# EAGLE schematic Rover v1 Overall (EAGLE 9.6.2)
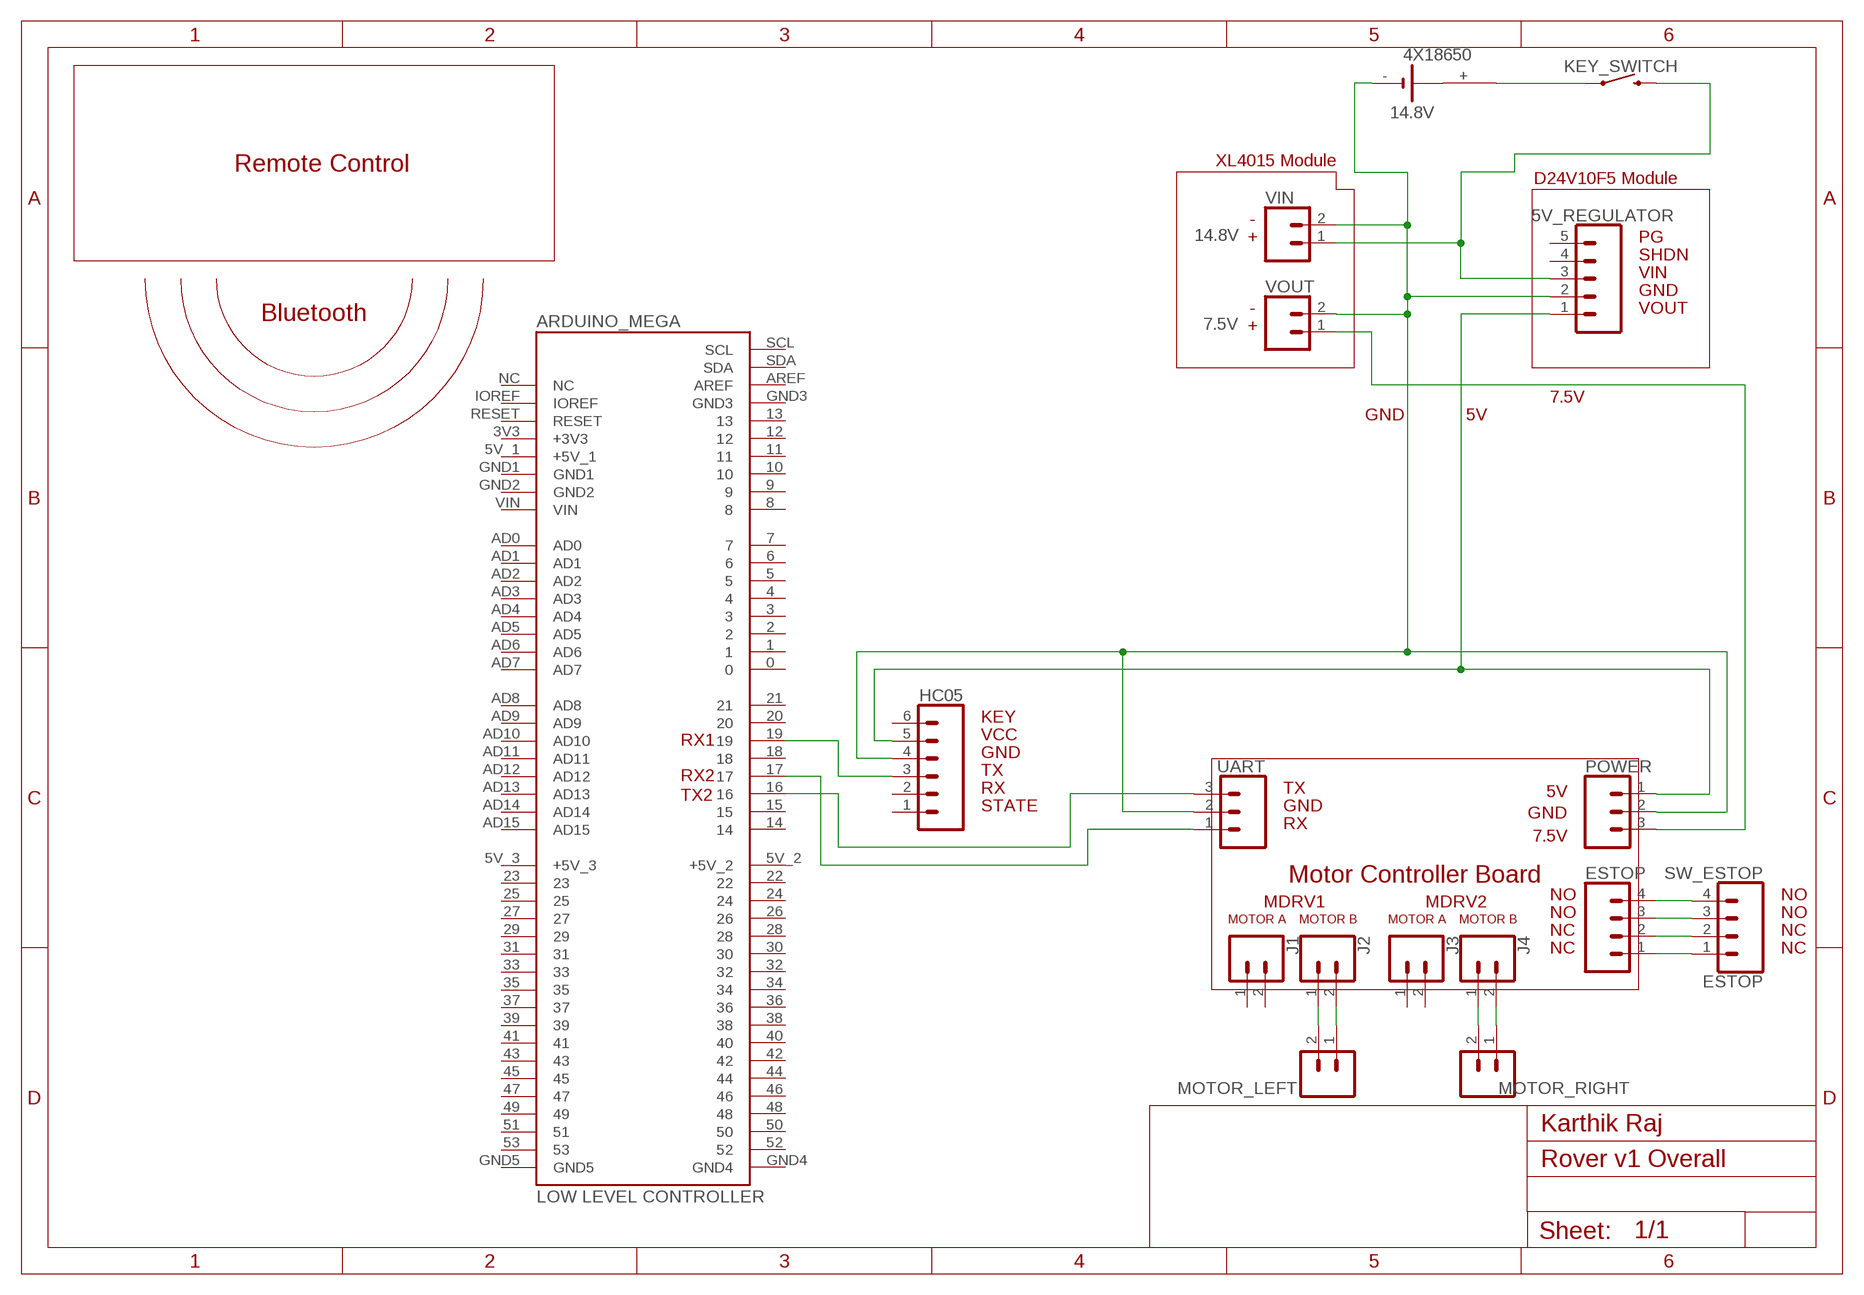
[diagram p0: schematic, sheet 1]

## Parts
4X18650  14.8V  B2430UNI  [B2430UNI]
5V_REGULATOR  CONN_05  [1X05]
ARDUINO_MEGA  LOW LEVEL CONTROLLER  A000067  [ARDUINO_A000067]
ESTOP  CONN_04PTH  [1X04]
HC05  CONN_06SILK_FEMALE_PTH  [1X06]
J1  CONN_02  [1X02]
J2  CONN_02  [1X02]
J3  CONN_02  [1X02]
J4  CONN_02  [1X02]
KEY_SWITCH  MOMENTARY-SWITCH-SPST-PTH-6.0MM  [TACTILE_SWITCH_PTH_6.0MM]
MOTOR_LEFT  CONN_02  [1X02]
MOTOR_RIGHT  CONN_02  [1X02]
POWER  CONN_03  [1X03]
SW_ESTOP  ESTOP  CONN_04PTH  [1X04]
UART  CONN_03  [1X03]
VIN  14.8V  CONN_02  [1X02]
VOUT  7.5V  CONN_02  [1X02]

## Nets
GND: 4X18650.- 5V_REGULATOR.2 HC05.4 POWER.2 UART.2 VIN.2 VOUT.2
N$1: ARDUINO_MEGA.16 UART.3
N$2: 5V_REGULATOR.3 KEY_SWITCH.3 VIN.1
N$3: ARDUINO_MEGA.17 UART.1
N$4: ESTOP.4 SW_ESTOP.4
N$5: ESTOP.3 SW_ESTOP.3
N$6: POWER.3 VOUT.1
N$7: ESTOP.2 SW_ESTOP.2
N$8: ESTOP.1 SW_ESTOP.1
N$9: J2.1 MOTOR_LEFT.2
N$10: J2.2 MOTOR_LEFT.1
N$11: J4.1 MOTOR_RIGHT.2
N$12: J4.2 MOTOR_RIGHT.1
N$13: 4X18650.+ KEY_SWITCH.1
TX: ARDUINO_MEGA.19 HC05.3
VCC: 5V_REGULATOR.1 HC05.5 POWER.1
Unconnected: 4X18650.+@1(+) 4X18650.+@2(+) 4X18650.+@3(+) 4X18650.+@4(+) 4X18650.-@1(-) 5V_REGULATOR.4 5V_REGULATOR.5 ARDUINO_MEGA.0 ARDUINO_MEGA.1 ARDUINO_MEGA.2 ARDUINO_MEGA.3 ARDUINO_MEGA.3V3(+3V3) ARDUINO_MEGA.4 ARDUINO_MEGA.5 ARDUINO_MEGA.5V_1(+5V_1) ARDUINO_MEGA.5V_2(+5V_2) ARDUINO_MEGA.5V_3(+5V_3) ARDUINO_MEGA.6 ARDUINO_MEGA.7 ARDUINO_MEGA.8 ARDUINO_MEGA.9 ARDUINO_MEGA.10 ARDUINO_MEGA.11 ARDUINO_MEGA.12 ARDUINO_MEGA.13 ARDUINO_MEGA.14 ARDUINO_MEGA.15 ARDUINO_MEGA.18 ARDUINO_MEGA.20 ARDUINO_MEGA.21 ARDUINO_MEGA.22 ARDUINO_MEGA.23 ARDUINO_MEGA.24 ARDUINO_MEGA.25 ARDUINO_MEGA.26 ARDUINO_MEGA.27 ARDUINO_MEGA.28 ARDUINO_MEGA.29 ARDUINO_MEGA.30 ARDUINO_MEGA.31 ARDUINO_MEGA.32 ARDUINO_MEGA.33 ARDUINO_MEGA.34 ARDUINO_MEGA.35 ARDUINO_MEGA.36 ARDUINO_MEGA.37 ARDUINO_MEGA.38 ARDUINO_MEGA.39 ARDUINO_MEGA.40 ARDUINO_MEGA.41 ARDUINO_MEGA.42 ARDUINO_MEGA.43 ARDUINO_MEGA.44 ARDUINO_MEGA.45 ARDUINO_MEGA.46 ARDUINO_MEGA.47 ARDUINO_MEGA.48 ARDUINO_MEGA.49 ARDUINO_MEGA.50 ARDUINO_MEGA.51 ARDUINO_MEGA.52 ARDUINO_MEGA.53 ARDUINO_MEGA.AD0 ARDUINO_MEGA.AD1 ARDUINO_MEGA.AD2 ARDUINO_MEGA.AD3 ARDUINO_MEGA.AD4 ARDUINO_MEGA.AD5 ARDUINO_MEGA.AD6 ARDUINO_MEGA.AD7 ARDUINO_MEGA.AD8 ARDUINO_MEGA.AD9 ARDUINO_MEGA.AD10 ARDUINO_MEGA.AD11 ARDUINO_MEGA.AD12 ARDUINO_MEGA.AD13 ARDUINO_MEGA.AD14 ARDUINO_MEGA.AD15 ARDUINO_MEGA.AREF ARDUINO_MEGA.GND1 ARDUINO_MEGA.GND2 ARDUINO_MEGA.GND3 ARDUINO_MEGA.GND4 ARDUINO_MEGA.GND5 ARDUINO_MEGA.IOREF ARDUINO_MEGA.NC ARDUINO_MEGA.RESET ARDUINO_MEGA.SCL ARDUINO_MEGA.SDA ARDUINO_MEGA.VIN HC05.1 HC05.2 HC05.6 J1.1 J1.2 J3.1 J3.2

## Notes on the sheet
- XL4015 Module
- Remote Control
- D24V10F5 Module
- -
- + | PG
- SHDN
- VIN
- GND
- - | VOUT
- Bluetooth
- +
- 7.5V
- GND | 5V
- KEY
- VCC
- RX1
- GND
- TX
- RX2 | 5V
- RX | TX
- TX2
- GND
- STATE | GND
- RX | 7.5V
- Motor Controller Board
- NO | NO
- MDRV1 | MDRV2
- NO | NO
- MOTOR A | MOTOR B | MOTOR A | MOTOR B
- NC | NC
- NC | NC
- Karthik Raj

## Library data of the parts
4X18650 = battery:B2430UNI: LI BATTERY
5V_REGULATOR = SparkFun-Connectors:CONN_05: Multi connection point. Often used as Generic Header-pin footprint for 0.1 inch spaced/style header connections On any of the 0.1 inch spaced packages, you can populate with these: Break Away Headers - Straight <https://www.sparkfun.com/products/116> (PRT-00116) Break Away Male Headers - Right Angle <https://www.sparkfun.com/products/553> (PRT-00553) Female Headers <https://www.sparkfun.com/products/115> (PRT-00115) Break Away Headers - Machine Pin <https://www.sparkfun.com/products/117> (PRT-00117) Break Away Female Headers - Swiss Machine Pin <https://www.sparkfun.com/products/743> (PRT-00743) For SCREWTERMINALS and SPRING TERMINALS visit here: Screw Terimnals on SparkFun.com <https://www.sparkfun.com/search/results?term=Screw+Terminals> (5mm/3.5mm/2.54mm spacing) This device is also useful as a general connection point to wire up your design to another part of your project. Our various solder wires solder well into these plated through hole pads. Hook-Up Wire - Assortment (Stranded, 22 AWG) <https://www.sparkfun.com/products/11375> (PRT-11375) Hook-Up Wire - Assortment (Solid Core, 22 AWG) <https://www.sparkfun.com/products/11367> (PRT-11367) View the entire wire category on our website here <https://www.sparkfun.com/categories/141> Special notes: Molex polarized connector foot print use with SKU : PRT-08231 with associated crimp pins and housings. 1MM SMD Version SKU: PRT-10208
ARDUINO_MEGA = Arduino Mega:A000067: ARDUINO UNO REV3 DEVELOPMENT BOARD Check availability <https://pricing.snapeda.com/parts/A000067/Arduino/view-part?ref=eda>; AVAILABILITY: In Stock; DESCRIPTION: Arduino Mega 2560 Rev3. ATmega2560 Microcontroller Mega Development Board 16MHz CPU 8KB RAM 4KB/256KB EEPROM/Flash; MF: Arduino; MP: A000067; PACKAGE: Non-Standard Arduino; PRICE: None; PURCHASE-URL: https://pricing.snapeda.com/search/part/A000067/?ref=eda
ESTOP SW_ESTOP = SparkFun-Connectors:CONN_04: Multi connection point. Often used as Generic Header-pin footprint for 0.1 inch spaced/style header connections On any of the 0.1 inch spaced packages, you can populate with these: Break Away Headers - Straight <https://www.sparkfun.com/products/116> (PRT-00116) Break Away Male Headers - Right Angle <https://www.sparkfun.com/products/553> (PRT-00553) Female Headers <https://www.sparkfun.com/products/115> (PRT-00115) Break Away Headers - Machine Pin <https://www.sparkfun.com/products/117> (PRT-00117) Break Away Female Headers - Swiss Machine Pin <https://www.sparkfun.com/products/743> (PRT-00743) For SCREWTERMINALS and SPRING TERMINALS visit here: Screw Terimnals on SparkFun.com <https://www.sparkfun.com/search/results?term=Screw+Terminals> (5mm/3.5mm/2.54mm spacing) This device is also useful as a general connection point to wire up your design to another part of your project. Our various solder wires solder well into these plated through hole pads. Hook-Up Wire - Assortment (Stranded, 22 AWG) <https://www.sparkfun.com/products/11375> (PRT-11375) Hook-Up Wire - Assortment (Solid Core, 22 AWG) <https://www.sparkfun.com/products/11367> (PRT-11367) View the entire wire category on our website here <https://www.sparkfun.com/categories/141> Special notes: Molex polarized connector foot print use with SKU : PRT-08231 with associated crimp pins and housings. 1MM SMD Version SKU: PRT-10208; PROD_ID: CONN-09696
HC05 = SparkFun-Connectors:CONN_06: Multi connection point. Often used as Generic Header-pin footprint for 0.1 inch spaced/style header connections On any of the 0.1 inch spaced packages, you can populate with these: Break Away Headers - Straight <https://www.sparkfun.com/products/116> (PRT-00116) Break Away Male Headers - Right Angle <https://www.sparkfun.com/products/553> (PRT-00553) Female Headers <https://www.sparkfun.com/products/115> (PRT-00115) Break Away Headers - Machine Pin <https://www.sparkfun.com/products/117> (PRT-00117) Break Away Female Headers - Swiss Machine Pin <https://www.sparkfun.com/products/743> (PRT-00743) Arduino Stackable Header - 6 Pin <https://www.sparkfun.com/products/9280> (PRT-09280) For SCREWTERMINALS and SPRING TERMINALS visit here: Screw Terimnals on SparkFun.com <https://www.sparkfun.com/search/results?term=Screw+Terminals> (5mm/3.5mm/2.54mm spacing) This device is also useful as a general connection point to wire up your design to another part of your project. Our various solder wires solder well into these plated through hole pads. Hook-Up Wire - Assortment (Stranded, 22 AWG) <https://www.sparkfun.com/products/11375> (PRT-11375) Hook-Up Wire - Assortment (Solid Core, 22 AWG) <https://www.sparkfun.com/products/11367> (PRT-11367) View the entire wire category on our website here <https://www.sparkfun.com/categories/141>; PROD_ID: CONN-08437
J1-J4 MOTOR_LEFT MOTOR_RIGHT VIN VOUT = SparkFun-Connectors:CONN_02: Multi connection point. Often used as Generic Header-pin footprint for 0.1 inch spaced/style header connections On any of the 0.1 inch spaced packages, you can populate with these: Break Away Headers - Straight <https://www.sparkfun.com/products/116> (PRT-00116) Break Away Male Headers - Right Angle <https://www.sparkfun.com/products/553> (PRT-00553) Female Headers <https://www.sparkfun.com/products/115> (PRT-00115) Break Away Headers - Machine Pin <https://www.sparkfun.com/products/117> (PRT-00117) Break Away Female Headers - Swiss Machine Pin <https://www.sparkfun.com/products/743> (PRT-00743) For SCREWTERMINALS and SPRING TERMINALS visit here: Screw Terimnals on SparkFun.com <https://www.sparkfun.com/search/results?term=Screw+Terminals> (5mm/3.5mm/2.54mm spacing) This device is also useful as a general connection point to wire up your design to another part of your project. Our various solder wires solder well into these plated through hole pads. Hook-Up Wire - Assortment (Stranded, 22 AWG) <https://www.sparkfun.com/products/11375> (PRT-11375) Hook-Up Wire - Assortment (Solid Core, 22 AWG) <https://www.sparkfun.com/products/11367> (PRT-11367) View the entire wire category on our website here <https://www.sparkfun.com/categories/141> Special notes: Molex polarized connector foot print use with: PRT-08233 with associated crimp pins and housings. 2.54_SCREWTERM for use with PRT-10571. 3.5mm Screw Terminal footprints for PRT-08084 5mm Screw Terminal footprints for use with PRT-08432
KEY_SWITCH = SparkFun-Switches:MOMENTARY-SWITCH-SPST: Momentary Switch (Pushbutton) - SPST Normally-open (NO) SPST momentary switches (buttons, pushbuttons). Variants PTH-12MM - 12mm square, through-hole Momentary Pushbutton Switch - 12mm Square <https://www.sparkfun.com/products/9190> (COM-09190) PTH-6.0MM, PTH-6.0MM-KIT - 6.0mm square, through-hole Mini Pushbutton Switch <https://www.sparkfun.com/products/97> (COM-00097) KIT package intended for soldering kit's - only one side of pads' copper is exposed. PTH-RIGHT-ANGLE-KIT - Right-angle, through-hole Right Angle Tactile Button <https://www.sparkfun.com/products/10791> - Used on SparkFun BigTime Watch Kit <https://www.sparkfun.com/products/11734> SMD-12MM - 12mm square, surface-mount Tactile Button - SMD (12mm) <https://www.sparkfun.com/products/12993> (COM-12993) Used on SparkFun PicoBoard <https://www.sparkfun.com/products/11888> SMD-4.5MM - 4.5mm Square Trackball Switch Used on SparkFun Blackberry Trackballer Breakout <https://www.sparkfun.com/products/13169> SMD-4.6MMX2.8MM - 4.60mm x 2.80mm, surface mount Used on SparkFun SAMD21 Mini Breakout <https://www.sparkfun.com/products/13664> SMD-5.2MM, SMD-5.2-REDUNDANT - 5.2mm square, surface-mount Mini Pushbutton Switch - SMD <https://www.sparkfun.com/products/8720> (COM-08720) Used on Arduino Pro Mini <https://www.sparkfun.com/products/11114> REDUNDANT package connects both switch circuits together SMD-6.0X3.5MM - 6.0 x 3.5mm, surface mount Momentary Reset Switch SMD <https://www.sparkfun.com/products/8229> (COM-08229) SMD-6.2MM-TALL - 6.2mm square, surface mount Tactile Button - SMD (6mm) <https://www.sparkfun.com/products/12992> Used on SparkFun Digital Sandbox <https://www.sparkfun.com/products/12651> SMD-RIGHT-ANGLE - Right-angle, surface mount Used on SparkFun Block for Intel® Edison - Arduino <https://www.sparkfun.com/products/13036>; PROD_ID: SWCH-08441; SF_SKU: COM-00097
POWER UART = SparkFun-Connectors:CONN_03: Multi connection point. Often used as Generic Header-pin footprint for 0.1 inch spaced/style header connections On any of the 0.1 inch spaced packages, you can populate with these: Break Away Headers - Straight <https://www.sparkfun.com/products/116> (PRT-00116) Break Away Male Headers - Right Angle <https://www.sparkfun.com/products/553> (PRT-00553) Female Headers <https://www.sparkfun.com/products/115> (PRT-00115) Break Away Headers - Machine Pin <https://www.sparkfun.com/products/117> (PRT-00117) Break Away Female Headers - Swiss Machine Pin <https://www.sparkfun.com/products/743> (PRT-00743) Stackable Header - 3 Pin (Female, 0.1") <https://www.sparkfun.com/products/13875> (PRT-13875) For SCREWTERMINALS and SPRING TERMINALS visit here: Screw Terimnals on SparkFun.com <https://www.sparkfun.com/search/results?term=Screw+Terminals> (5mm/3.5mm/2.54mm spacing) This device is also useful as a general connection point to wire up your design to another part of your project. Our various solder wires solder well into these plated through hole pads. Hook-Up Wire - Assortment (Stranded, 22 AWG) <https://www.sparkfun.com/products/11375> (PRT-11375) Hook-Up Wire - Assortment (Solid Core, 22 AWG) <https://www.sparkfun.com/products/11367> (PRT-11367) View the entire wire category on our website here <https://www.sparkfun.com/categories/141> Special notes: Molex polarized connector foot print use with SKU : PRT-08232 with associated crimp pins and housings.; PROD_ID: XXX-00000; VALUE: 455-1750-1-ND